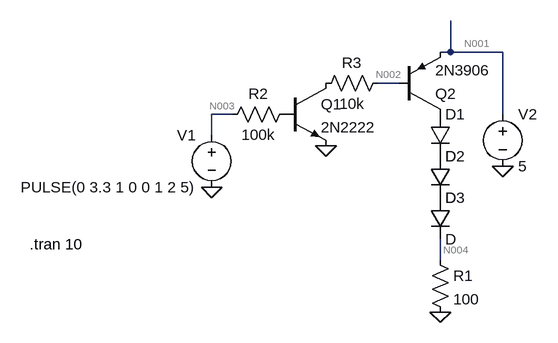
[diagram p0: schematic LED_Driver.asc]
LED_Driver.asc, the LTspice schematic file:
Version 4
SHEET 1 880 680
WIRE 368 32 368 -16
WIRE 368 32 352 32
WIRE 448 32 368 32
WIRE 288 80 256 80
WIRE 32 128 0 128
WIRE 448 128 448 32
WIRE 0 160 0 128
WIRE 352 352 352 320
FLAG 0 240 0
FLAG 448 208 0
FLAG 176 176 0
FLAG 352 432 0
SYMBOL voltage 0 144 M0
WINDOW 123 0 0 Left 2
WINDOW 39 0 0 Left 2
SYMATTR InstName V1
SYMATTR Value PULSE(0 3.3 1 0 0 1 2 5)
SYMBOL voltage 448 112 R0
WINDOW 123 0 0 Left 2
WINDOW 39 24 124 Left 2
SYMATTR InstName V2
SYMATTR Value 5
SYMBOL pnp 288 128 M180
SYMATTR InstName Q2
SYMATTR Value 2N3906
SYMBOL npn 112 80 R0
SYMATTR InstName Q1
SYMATTR Value 2N2222
SYMBOL res 16 144 R270
WINDOW 0 32 56 VTop 2
WINDOW 3 0 56 VBottom 2
SYMATTR InstName R2
SYMATTR Value 100k
SYMBOL res 160 96 R270
WINDOW 0 32 56 VTop 2
WINDOW 3 0 56 VBottom 2
SYMATTR InstName R3
SYMATTR Value 10k
SYMBOL res 336 336 R0
SYMATTR InstName R1
SYMATTR Value 100
SYMBOL diode 336 128 R0
SYMATTR InstName D1
SYMBOL diode 336 192 R0
SYMATTR InstName D2
SYMBOL diode 336 256 R0
SYMATTR InstName D3
TEXT -280 328 Left 2 !.tran 10

The netlist it stands for:
* LED_Driver.asc
V1 N003 0 PULSE(0 3.3 1 0 0 1 2 5)
V2 N001 0 5
Q2 P001 N002 N001 0 2N3906
Q1 P002 P003 0 0 2N2222
R2 N003 P003 100k
R3 P002 N002 10k
R1 N004 0 100
D1 P001 P004 D
D2 P004 P005 D
D3 P005 N004 D
.model D D
.lib standard.dio
.model NPN NPN
.model PNP PNP
.lib standard.bjt
.tran 10
.backanno
.end

* Results of the author's LTspice run, read from the files saved beside the schematic
* Operating Point, zero values left out:
*   V(n001) = 5 V
*   V(p001) = 934.3 mV
*   V(n002) = 4.69 V
*   V(p002) = 4.69 V
*   V(p003) = 469.3 nV
*   V(n004) = 169.5 nV
*   V(p004) = 622.9 mV
*   V(p005) = 311.4 mV
*   Ic(Q1) = 4.704 pA
*   Ib(Q1) = -4.693 pA
*   Ic(Q2) = -1.695 nA
*   Ib(Q2) = -4.704 pA
*   Ie(Q2) = 1.7 nA
*   I(D3) = 1.695 nA
*   I(D2) = 1.695 nA
*   I(D1) = 1.695 nA
*   I(R1) = 1.695 nA
*   I(R3) = -4.704 pA
*   I(R2) = -4.693 pA
*   I(V2) = -1.7 nA
*   I(V1) = 4.693 pA
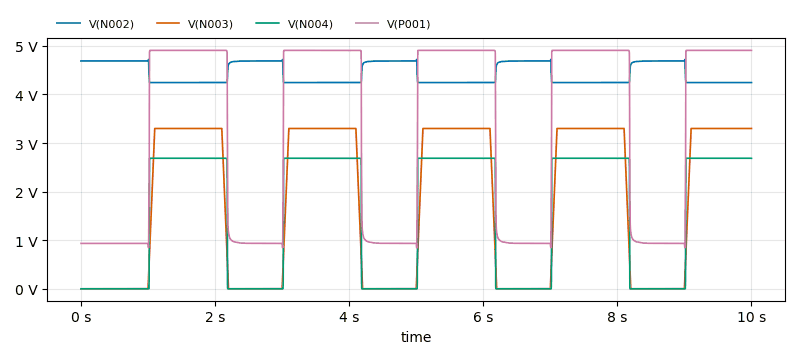
[diagram p1: Transient Analysis of LED_Driver.asc, plotted from the saved traces]
* Transient Analysis, 1 run:
*   V(N002): min 4.246 V, max 4.722 V, average 4.436 V, rms 4.441 V, last 4.246 V
*   V(N003): min 0 V, max 3.3 V, average 1.765 V, rms 2.38 V, last 3.3 V
*   V(N004): min 0 V, max 2.687 V, average 1.514 V, rms 2.016 V, last 2.687 V
*   V(P001): min 840 mV, max 4.908 V, average 3.185 V, rms 3.738 V, last 4.908 V